# Altium schematic sheet Over Discharge Protection_SCHEMATIC.SchDoc
size A4; SheetNumber: 2; SheetTotal: 5
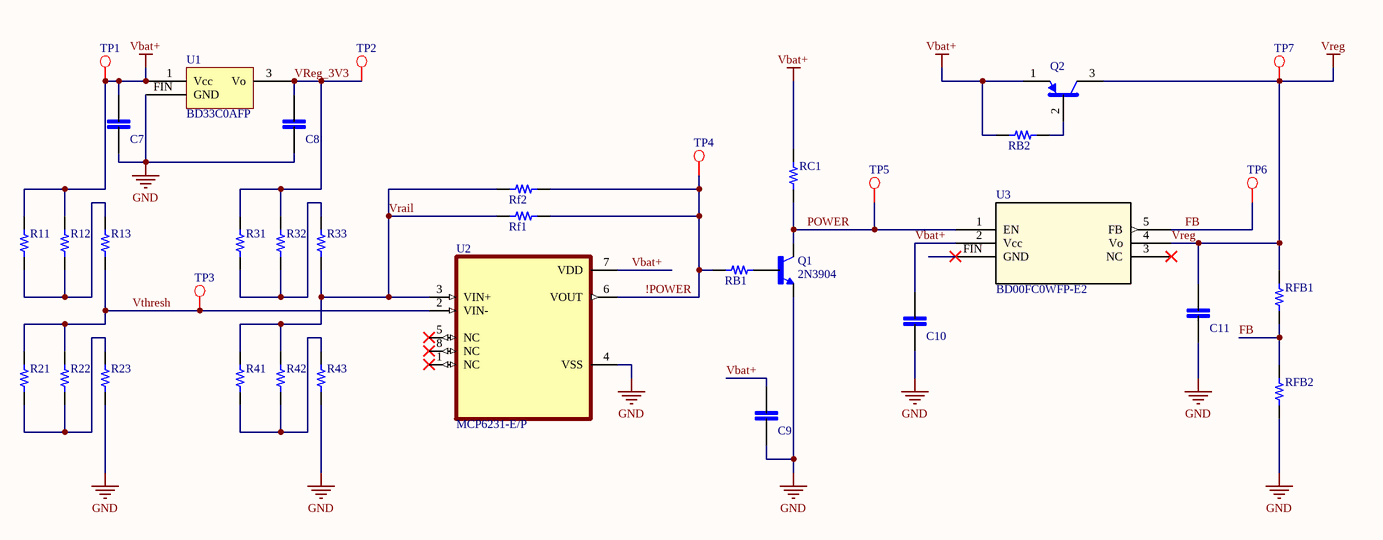
[diagram p0: Over Discharge Protection_SCHEMATIC.SchDoc]

## Parts
C7  0805  [Capacitor 0805]  (value not drawn)
C8  0805  [Capacitor 0805]  (value not drawn)
C9  0805  [Capacitor 0805]  (value not drawn)
C10  0805  [Capacitor 0805]  (value not drawn)
C11  0805  [Capacitor 0805]  (value not drawn)
Q1  2N3904  [2N3904]
Q2  2N3906  [2N3904]  (value not drawn)
R11  Resistor Axial  [Resistor Axial]  (value not drawn)
R12  Resistor Axial  [Resistor Axial]  (value not drawn)
R13  Resistor Axial  [Resistor Axial]  (value not drawn)
R21  Resistor Axial  [Resistor Axial]  (value not drawn)
R22  Resistor Axial  [Resistor Axial]  (value not drawn)
R23  Resistor Axial  [Resistor Axial]  (value not drawn)
R31  Resistor Axial  [Resistor Axial]  (value not drawn)
R32  Resistor Axial  [Resistor Axial]  (value not drawn)
R33  Resistor Axial  [Resistor Axial]  (value not drawn)
R41  Resistor Axial  [Resistor Axial]  (value not drawn)
R42  Resistor Axial  [Resistor Axial]  (value not drawn)
R43  Resistor Axial  [Resistor Axial]  (value not drawn)
RB1  Resistor Axial  [Resistor Axial]  (value not drawn)
RB2  Resistor Axial  [Resistor Axial]  (value not drawn)
RC1  Resistor Axial  [Resistor Axial]  (value not drawn)
Rf1  Resistor Axial  [Resistor Axial]  (value not drawn)
Rf2  Resistor Axial  [Resistor Axial]  (value not drawn)
RFB1  Resistor Axial  [Resistor Axial]  (value not drawn)
RFB2  Resistor Axial  [Resistor Axial]  (value not drawn)
TP1  Test Point  [Test Point]  (value not drawn)
TP2  Test Point  [Test Point]  (value not drawn)
TP3  Test Point  [Test Point]  (value not drawn)
TP4  Test Point  [Test Point]  (value not drawn)
TP5  Test Point  [Test Point]  (value not drawn)
TP6  Test Point  [Test Point]  (value not drawn)
TP7  Test Point  [Test Point]  (value not drawn)
U1  BD33C0AFP  [BD33C0AFP]
U2  MCP6231-E/P  [MCP6231-E/P]
U3  BD00FC0WFP-E2  [BD00FC0WFP-E2]

## Nets
GND: C7.1 C8.1 C9.1 C10.1 C11.1 Q1.1(E) R23.1 R43.1 RFB2.1 U1.FIN(GND) U2.4(VSS)
Vbat+: C7.2 C9.2 C10.2 Q2.1(E) R11.2 R12.2 RB2.2 RC1.2 TP1.TP?(Test_Point) U1.1(Vcc) U2.7(VDD) U3.2(Vcc)
Vreg: C11.2 Q2.3(C) RFB1.2 TP7.TP?(Test_Point) U3.4(Vo)
!POWER: RB1.2 Rf1.1 Rf2.1 TP4.TP?(Test_Point) U2.6(VOUT)
FB: RFB1.1 RFB2.2 TP6.TP?(Test_Point) U3.5(FB)
POWER: Q1.3(C) RC1.1 TP5.TP?(Test_Point) U3.1(EN)
Vrail: R33.1 R41.2 R42.2 Rf1.2 Rf2.2 U2.3(VIN+)
VReg_3V3: C8.2 R31.2 R32.2 TP2.TP?(Test_Point) U1.3(Vo)
Vthresh: R13.1 R21.2 R22.2 TP3.TP?(Test_Point) U2.2(VIN-)
NetQ1_2: Q1.2(B) RB1.1
NetQ2_2: Q2.2(B) RB2.1
NetR11_1: R11.1 R12.1 R13.2
NetR21_1: R21.1 R22.1 R23.2
NetR31_1: R31.1 R32.1 R33.2
NetR41_1: R41.1 R42.1 R43.2

Not connected (* = marked no-connect by the designer): U2 1(NC)* 5(NC)* 8(NC)*; U3 3(NC)* FIN(GND)*

## Library data of the parts
C7-C11 = Capacitor 0805